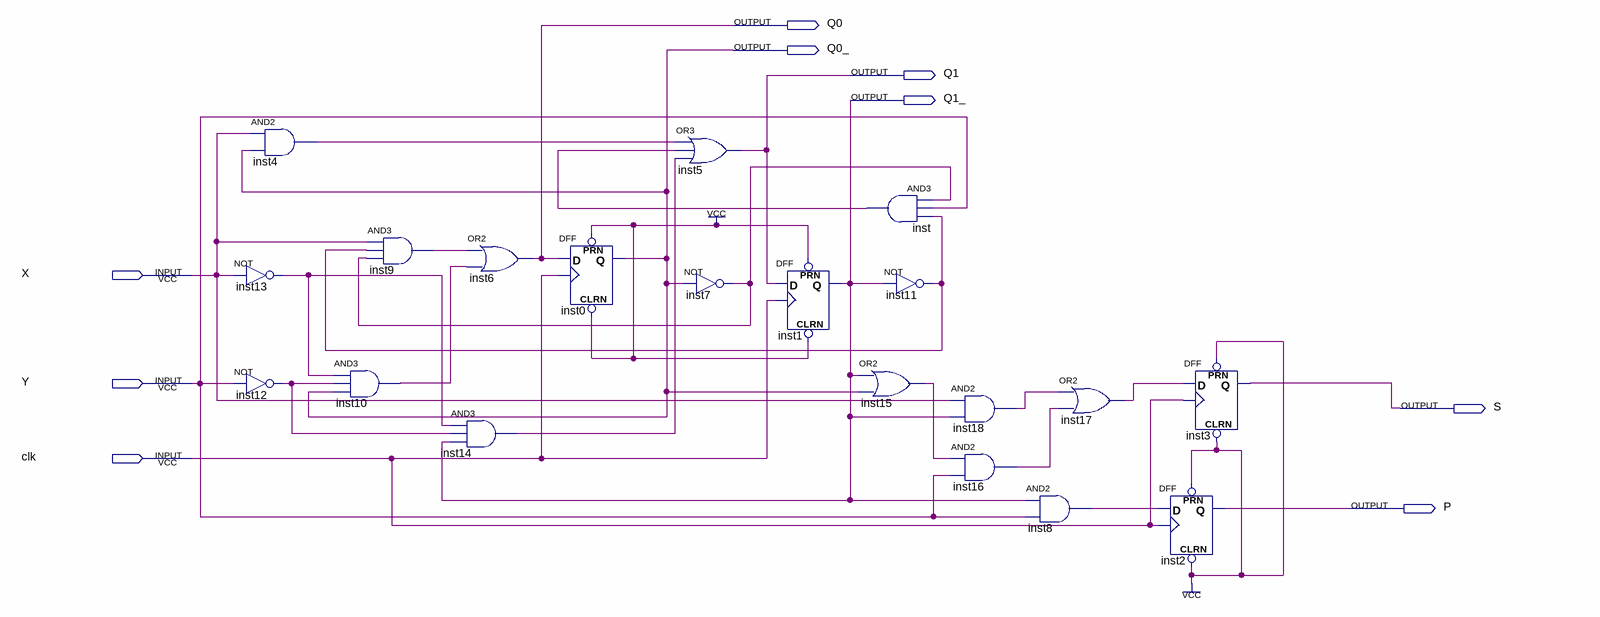
[diagram p0: schematic sheet]
// Quartus schematic autoseller.bdf as structural Verilog: 20 symbols, 9 pins
module autoseller (
  input  X,
  input  Y,
  input  clk,
  output Q0,
  output Q0_,
  output Q1,
  output Q1_,
  output S,
  output P
);

  wire inst4_out, inst7_out, inst8_out, inst9_out, inst10_out, inst11_out, inst12_out, inst13_out,
       inst14_out, inst15_out, inst16_out, inst17_out, inst18_out, inst_out;

  and inst4 (inst4_out, X, Q0_);
  not inst13 (inst13_out, X);
  not inst12 (inst12_out, Y);
  and inst9 (inst9_out, X, inst11_out, inst7_out);
  and inst10 (inst10_out, inst13_out, inst12_out, Q0_);
  and inst14 (inst14_out, inst13_out, inst12_out, Q1_);
  or inst6 (Q0, inst9_out, inst10_out);
  DFF inst0 (.CLRN(1'b1), .CLK(clk), .D(Q0), .PRN(1'b1), .Q(Q0_));
  or inst5 (Q1, inst4_out, inst_out, inst14_out);
  not inst7 (inst7_out, Q0_);
  DFF inst1 (.CLRN(1'b1), .CLK(clk), .D(Q1), .PRN(1'b1), .Q(Q1_));
  and inst (inst_out, inst7_out, Y, inst11_out);
  not inst11 (inst11_out, Q1_);
  or inst15 (inst15_out, Q1_, Q0_);
  and inst18 (inst18_out, X, Q1_);
  and inst16 (inst16_out, inst15_out, Y);
  and inst8 (inst8_out, Q1_, Y);
  or inst17 (inst17_out, inst18_out, inst16_out);
  DFF inst3 (.CLRN(1'b1), .CLK(clk), .D(inst17_out), .PRN(1'b1), .Q(S));
  DFF inst2 (.CLRN(1'b1), .CLK(clk), .D(inst8_out), .PRN(1'b1), .Q(P));
endmodule
